# EasyEDA schematic ЧАТИКП v3.2.json
TITLE: ЧАТИКП; REV: 3.2; Date: 2022-11-17; Sheet: 1/1
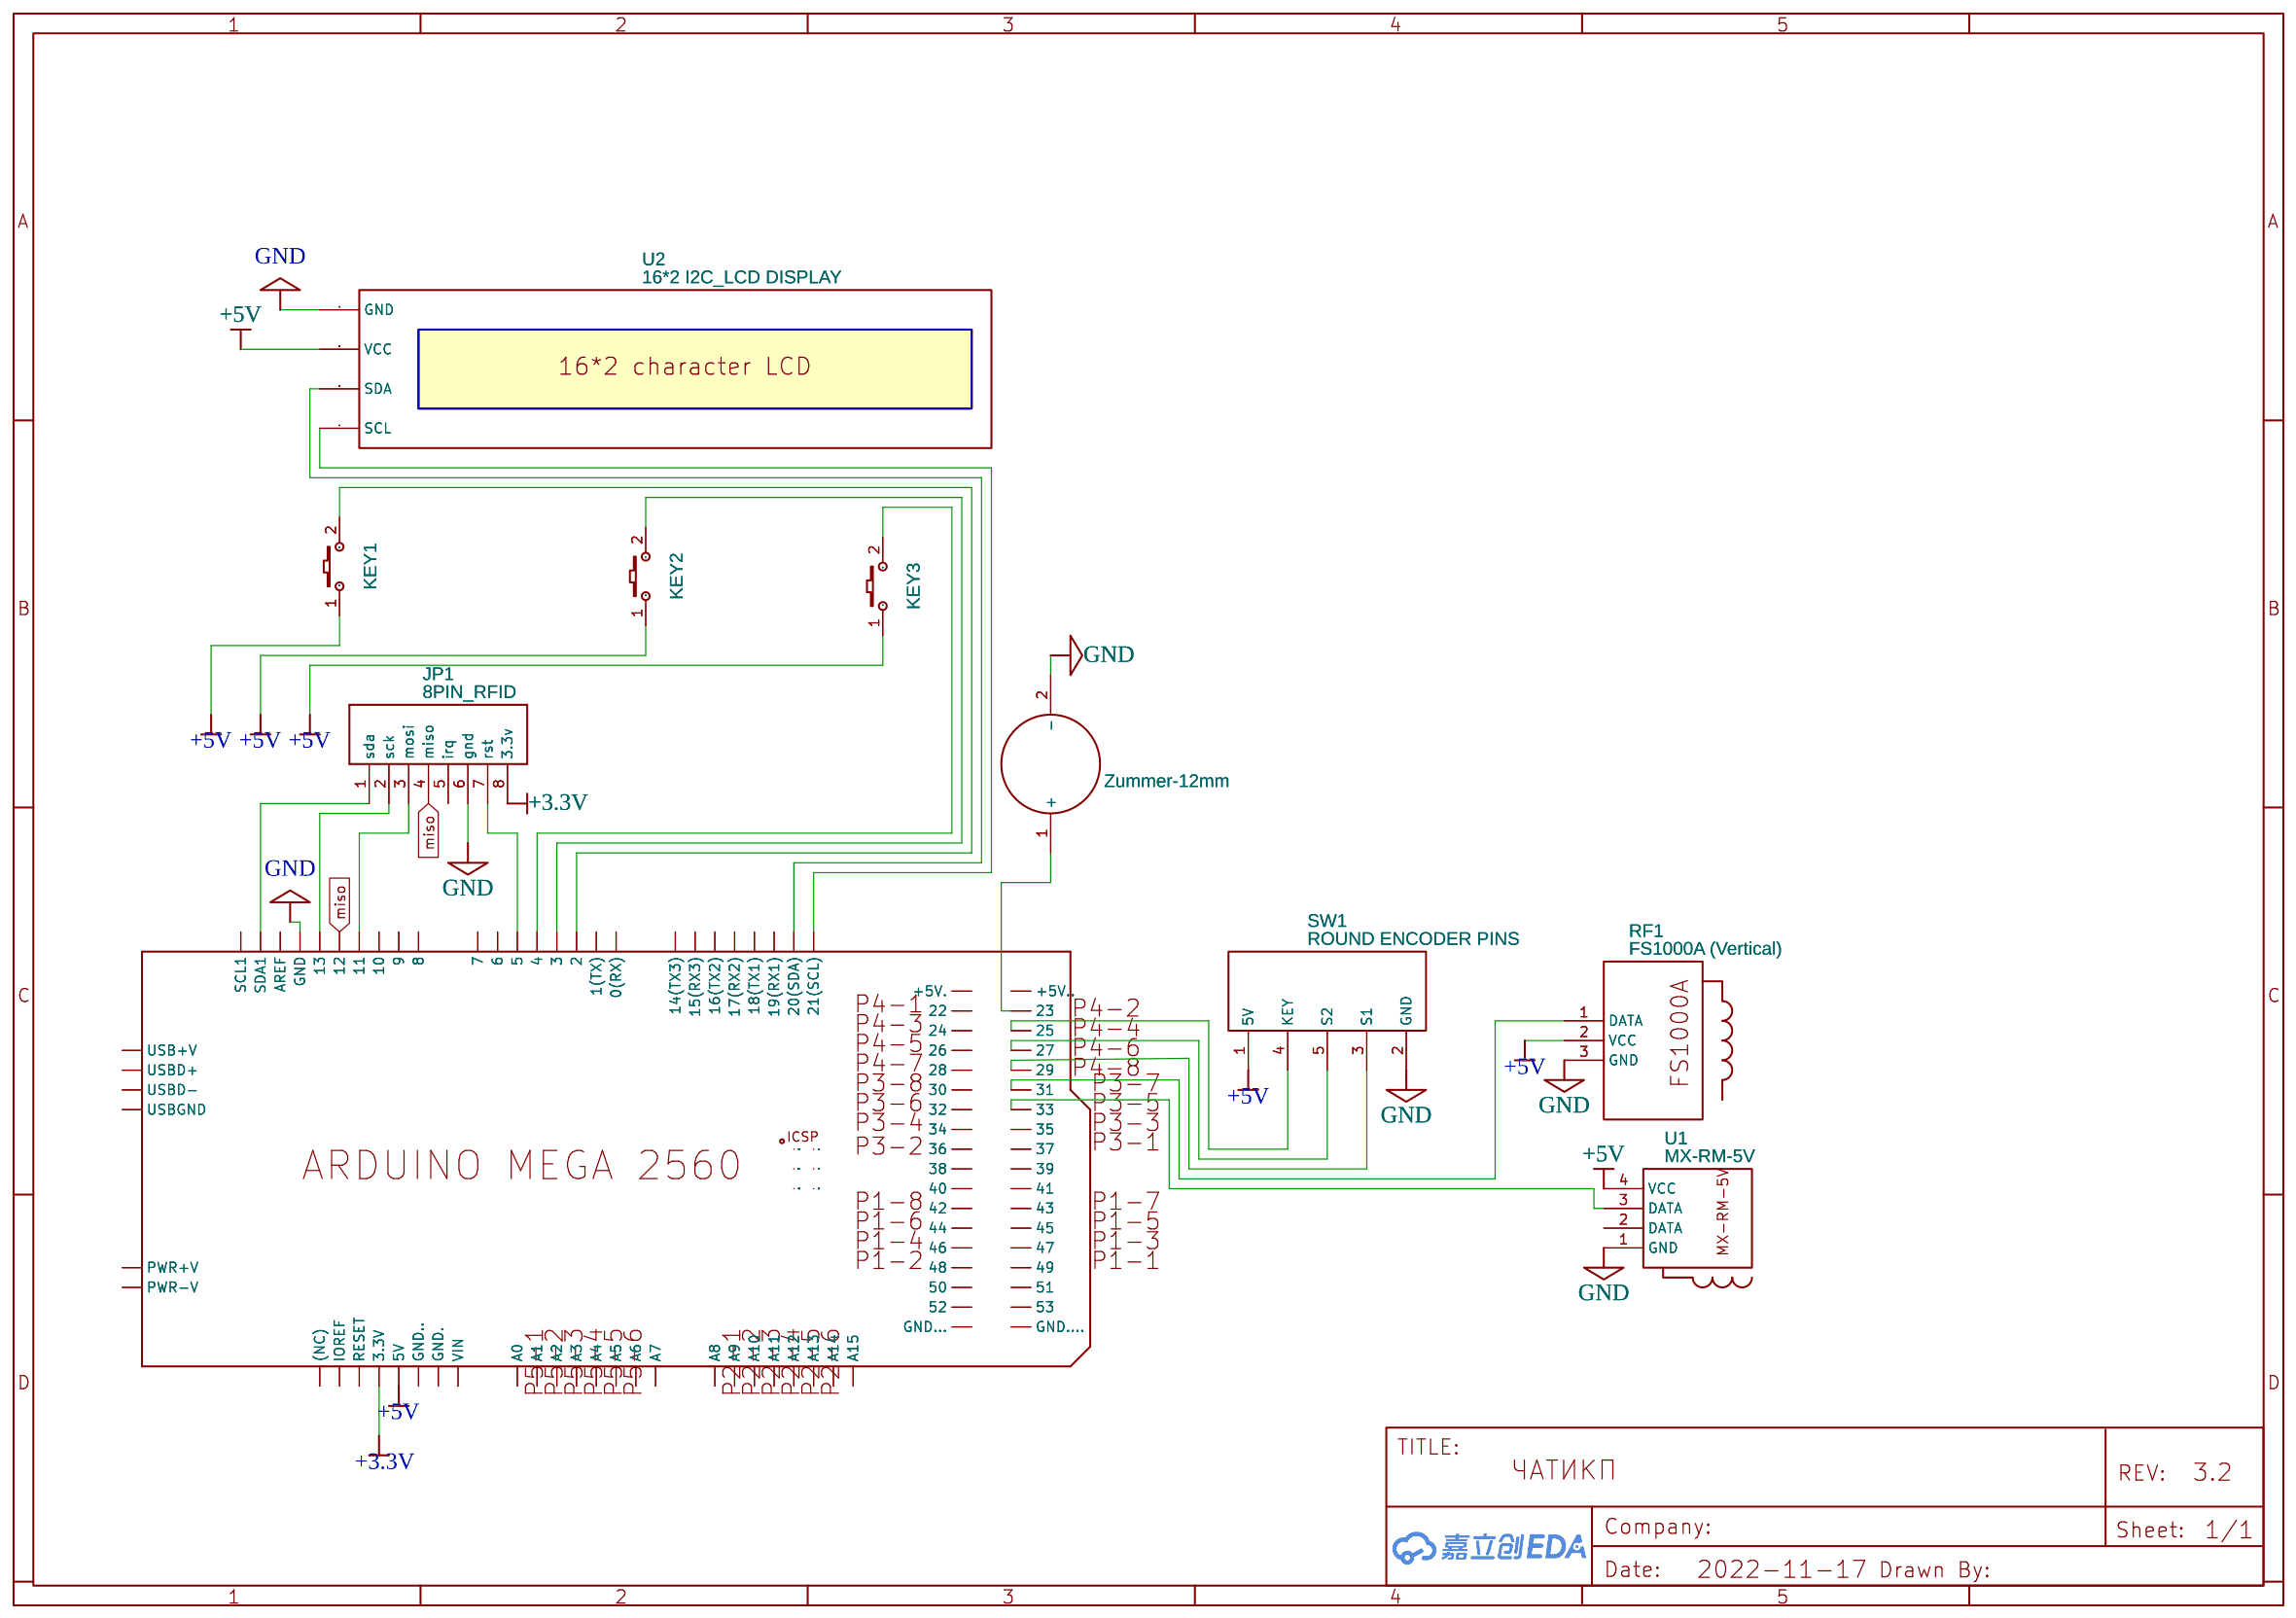
[diagram p0: schematic sheet]

## Parts
JP1  8PIN_RFID  [RFID-RC522]
KEY1  K2-3.6×6.1_SMD  [KEY-SMD_2P-L6.2-W3.6-LS8.0]
KEY2  K2-3.6×6.1_SMD  [KEY-SMD_2P-L6.2-W3.6-LS8.0]
KEY3  K2-3.6×6.1_SMD  [KEY-SMD_2P-L6.2-W3.6-LS8.0]
PCB1  ARDUINO_MEGA2560_EXT  [ARDUINO-MEGA2560-EXT]
RF1  FS1000A (Vertical)  [FS1000A]
SW1  ROUND ENCODER PINS  [SW-TH_PEC11R-4XXXF-SXXXX]
U1  MX-RM-5V  [MX-RM-5V (VERTICAL)]
U2  16*2 I2C_LCD DISPLAY  [16*2_I2C_LCD DISPLAY]
U3  Zummer-12mm  [Y_ZUMMER-12MM]

## Library data of the parts
JP1 = 8PIN_RFID: Contributor: My Home
KEY1-KEY3 = K2-3.6×6.1_SMD: Supplier Part: C118141; Supplier: LCSC; Manufacturer Part: K2-1107ST-A4SW-06; Contributor: LCEDA_Lib; 制造商: 韩国韩荣
PCB1 = ARDUINO_MEGA2560_EXT: Device for representing an Arduino Mega 2560 board in an EAGLE design without the PCB footprint.  Created by Dave Young for Element14. More EAGLE documentation at: http:www.element14.comcommunitycommunityknodecadsoft_eagle
RF1 = FS1000A (Vertical): Contributor: kntznart
SW1 = ROUND ENCODER PINS: Supplier: LCSC; Supplier Part: C143789; Manufacturer: BOURNS; Manufacturer Part: PEC11R-4015F-S0024; Contributor: LCSC; LCSC Assembly: Yes; SMT Type: Extend
U1 = MX-RM-5V: Contributor: kntznart
U2 = 16*2 I2C_LCD DISPLAY: Supplier Part: undefined; Contributor: poppy0123
U3 = Y_Zummer-12mm: Contributor: itisnomail

## Nets
+3.3V: JP1.1(sda) JP1.2(sck) JP1.3(mosi) JP1.4(miso) JP1.6(gnd) JP1.7(rst) JP1.8(3.3v) KEY1.1 KEY1.2 KEY2.1 KEY2.2 KEY3.1 KEY3.2 PCB1.(MISO) RF1.1(DATA) RF1.2(VCC) RF1.3(GND) SW1.1(5V) SW1.2(GND) SW1.3(S1) SW1.4(KEY) SW1.5(S2) U1.1(GND) U1.3(DATA) U1.4(VCC) U2.1(GND) U2.2(VCC) U2.3(SDA) U2.4(SCL) U3.1(+) U3.2(-)

Not connected (* = marked no-connect by the designer): JP1 5(irq); U1 2(DATA)
